# Altium schematic sheet AMU-S11-V00-ContactorInterface.SchDoc: Contactor Interface
size A3; DrawnBy: Thomas Benedetti; DocumentNumber: 11; SheetNumber: 11; SheetTotal: 12; Version: 00; Project: AMU 2020; PageSetup: Record=PageOptions|CenterHorizontal=True|CenterVertical=True|PrintScale=0.97|XCorrection=1.00|YCorrection=1.00|PrintKind=0|BorderSize=5000000|LeftOffset=0|BottomOffset=0|Orientation=2|PaperLength=1000|PaperWidth=1000|Scale=100|PaperSource=7|PrintQuality=-4|MediaType=1|DitherType=10|PaperKind=A4|PrintScaleMode=1
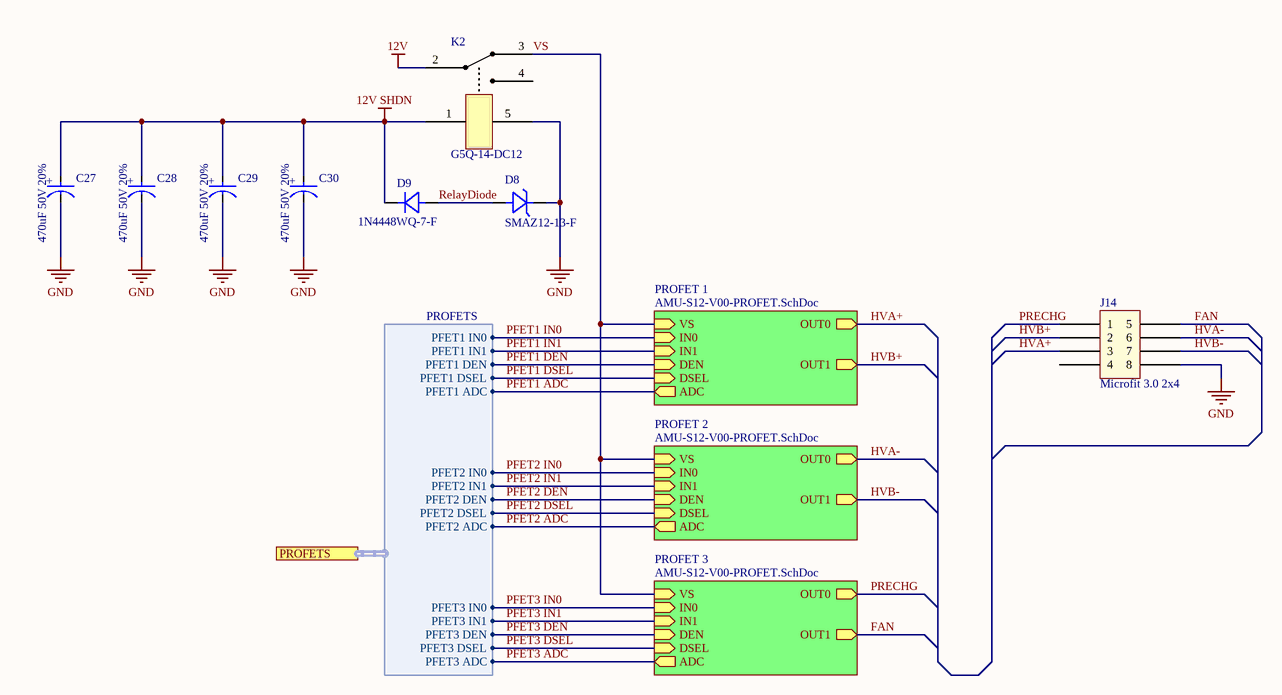
[diagram p0: AMU-S11-V00-ContactorInterface.SchDoc]

## Parts
C27  470uF 50V 20%  [CAP_ALU_TH]
C28  470uF 50V 20%  [CAP_ALU_TH]
C29  470uF 50V 20%  [CAP_ALU_TH]
C30  470uF 50V 20%  [CAP_ALU_TH]
D8  SMAZ12-13-F  [SMA]
D9  1N4448WQ-7-F  [SMA]
J14  Microfit 3.0 2x4  [Microfit_2X4_R_TH]
K2  G5Q-14-DC12  [G5Q-14]

## Sub-sheets
PROFET 1 = AMU-S12-V00-PROFET.SchDoc: VS (in), ADC (out), OUT0 (out), OUT1 (out), DSEL (in), DEN (in), IN1 (in), IN0 (in)
PROFET 2 = AMU-S12-V00-PROFET.SchDoc: VS (in), ADC (out), OUT0 (out), OUT1 (out), DSEL (in), DEN (in), IN1 (in), IN0 (in)
PROFET 3 = AMU-S12-V00-PROFET.SchDoc: VS (in), ADC (out), OUT0 (out), OUT1 (out), DSEL (in), DEN (in), IN1 (in), IN0 (in)

## Ports
PROFETS (harness PROFETS)

## Harnesses
PROFETS: PFET1 IN0, PFET1 IN1, PFET1 DEN, PFET1 DSEL, PFET1 ADC, PFET2 IN0, PFET2 IN1, PFET2 DEN, PFET2 DSEL, PFET2 ADC, PFET3 IN0, PFET3 DSEL, PFET3 ADC, PFET3 DEN, PFET3 IN1

## Nets
12V: K2.2
12V SHDN: C27.A C28.A C29.A C30.A D9.K(Cathode) K2.1
GND: C27.K C28.K C29.K C30.K D8.K(Cathode) J14.8 K2.5
FAN: J14.5 ; sheet PROFET 3/OUT1
HVA+: J14.3 ; sheet PROFET 1/OUT0
HVA-: J14.6 ; sheet PROFET 2/OUT0
HVB+: J14.2 ; sheet PROFET 1/OUT1
HVB-: J14.7 ; sheet PROFET 2/OUT1
PFET1 ADC: sheet PROFET 1/ADC, port PROFETS.PFET1 ADC
PFET1 DEN: sheet PROFET 1/DEN, port PROFETS.PFET1 DEN
PFET1 DSEL: sheet PROFET 1/DSEL, port PROFETS.PFET1 DSEL
PFET1 IN0: sheet PROFET 1/IN0, port PROFETS.PFET1 IN0
PFET1 IN1: sheet PROFET 1/IN1, port PROFETS.PFET1 IN1
PFET2 ADC: sheet PROFET 2/ADC, port PROFETS.PFET2 ADC
PFET2 DEN: sheet PROFET 2/DEN, port PROFETS.PFET2 DEN
PFET2 DSEL: sheet PROFET 2/DSEL, port PROFETS.PFET2 DSEL
PFET2 IN0: sheet PROFET 2/IN0, port PROFETS.PFET2 IN0
PFET2 IN1: sheet PROFET 2/IN1, port PROFETS.PFET2 IN1
PFET3 ADC: sheet PROFET 3/ADC, port PROFETS.PFET3 ADC
PFET3 DEN: sheet PROFET 3/DEN, port PROFETS.PFET3 DEN
PFET3 DSEL: sheet PROFET 3/DSEL, port PROFETS.PFET3 DSEL
PFET3 IN0: sheet PROFET 3/IN0, port PROFETS.PFET3 IN0
PFET3 IN1: sheet PROFET 3/IN1, port PROFETS.PFET3 IN1
PRECHG: J14.1 ; sheet PROFET 3/OUT0
RelayDiode: D8.A(Anode) D9.A(Anode)
VS: K2.3 ; sheet PROFET 3/VS, sheet PROFET 2/VS, sheet PROFET 1/VS

Not connected (* = marked no-connect by the designer): J14 4; K2 4

## Notes on the sheet
- Revision History:
- Sheet Title:
- Rev
- Date
- Description
- Project:
- Size:
- Drawn By:
- A3
- Number:
- Revision:
- Sheet
- Version:
- of
- QUT Motorsport
- O-120, Gardens Point
- 2 George Street
- Brisbane, QLD 4000
- Australia
- Print Date:
- Print Time:
- File Name:
- (in symbol 470uF 50V 20% Alum E-CAP) +

## Library data of the parts
C27-C30 = 470uF 50V 20% Alum E-CAP: 470µF 50V Aluminum Electrolytic Capacitors Radial, Can  5000 Hrs @ 105°C
D8 = SMAZ12-13-F: Zener Diode 12V 1W ±5% Surface Mount SMA; Manufacturer: ON Semiconductor; MPN: MM3Z56VB; ComponentLink1Description: Digikey; ComponentLink1URL: https://www.digikey.com.au/product-detail/en/diodes-incorporated/SMAZ12-13-F/SMAZ12-FDICT-ND/725073; ComponentLink2Description: Datasheet; ComponentLink2URL: https://www.diodes.com/assets/Datasheets/ds18015.pdf
D9 = 1N4448WQ-7-F: Diode, SMD, 75V, 5%, 250mA, SOD123; Manufacturer: ON Semiconductor / Fairchild; Manufacturer Part Number: 1N914BWS; Average Rectified Current: 150mA; Element Configuration: Single; Forward Voltage: 1V; Max Reverse Leakage Current: 5uA; Power Dissipation: 200mW; Recovery Time: 4ns; Max Forward Surge Current (Ifsm): 4A; Parameter 1: *; Weight: 0.0276g; Category: Rectifier Diodes; Contact Plating: Tin,Matte; Forward Current: 150mA; Lead Free: Lead Free; Max Operating Temperature: 150°C; Max Repetitive Reverse Voltage (Vrrm): 75V; Max Reverse Voltage (DC): 75V; Min Operating Temperature: -55°C; Mount: Surface Mount; Number of Pins: 2; Package Quantity: 1; Packaging: Tape and Reel; Peak Reverse Current: 5uA; Radiation Hardening: No; REACH SVHC: No SVHC; Reverse Recovery Time: 4ns; Height: 1mm; Length: 1.8mm; Reverse Voltage: 75V; Width: 1.35mm
J14 = Microfit_2x4
K2 = G5Q-14-DC12: General Purpose Relay SPDT (1 Form C) 12VDC Coil Through Hole, 12V, 16A